# EAGLE design powerSwitch011 (EAGLE 5.12)

## Sheet 1 of 3
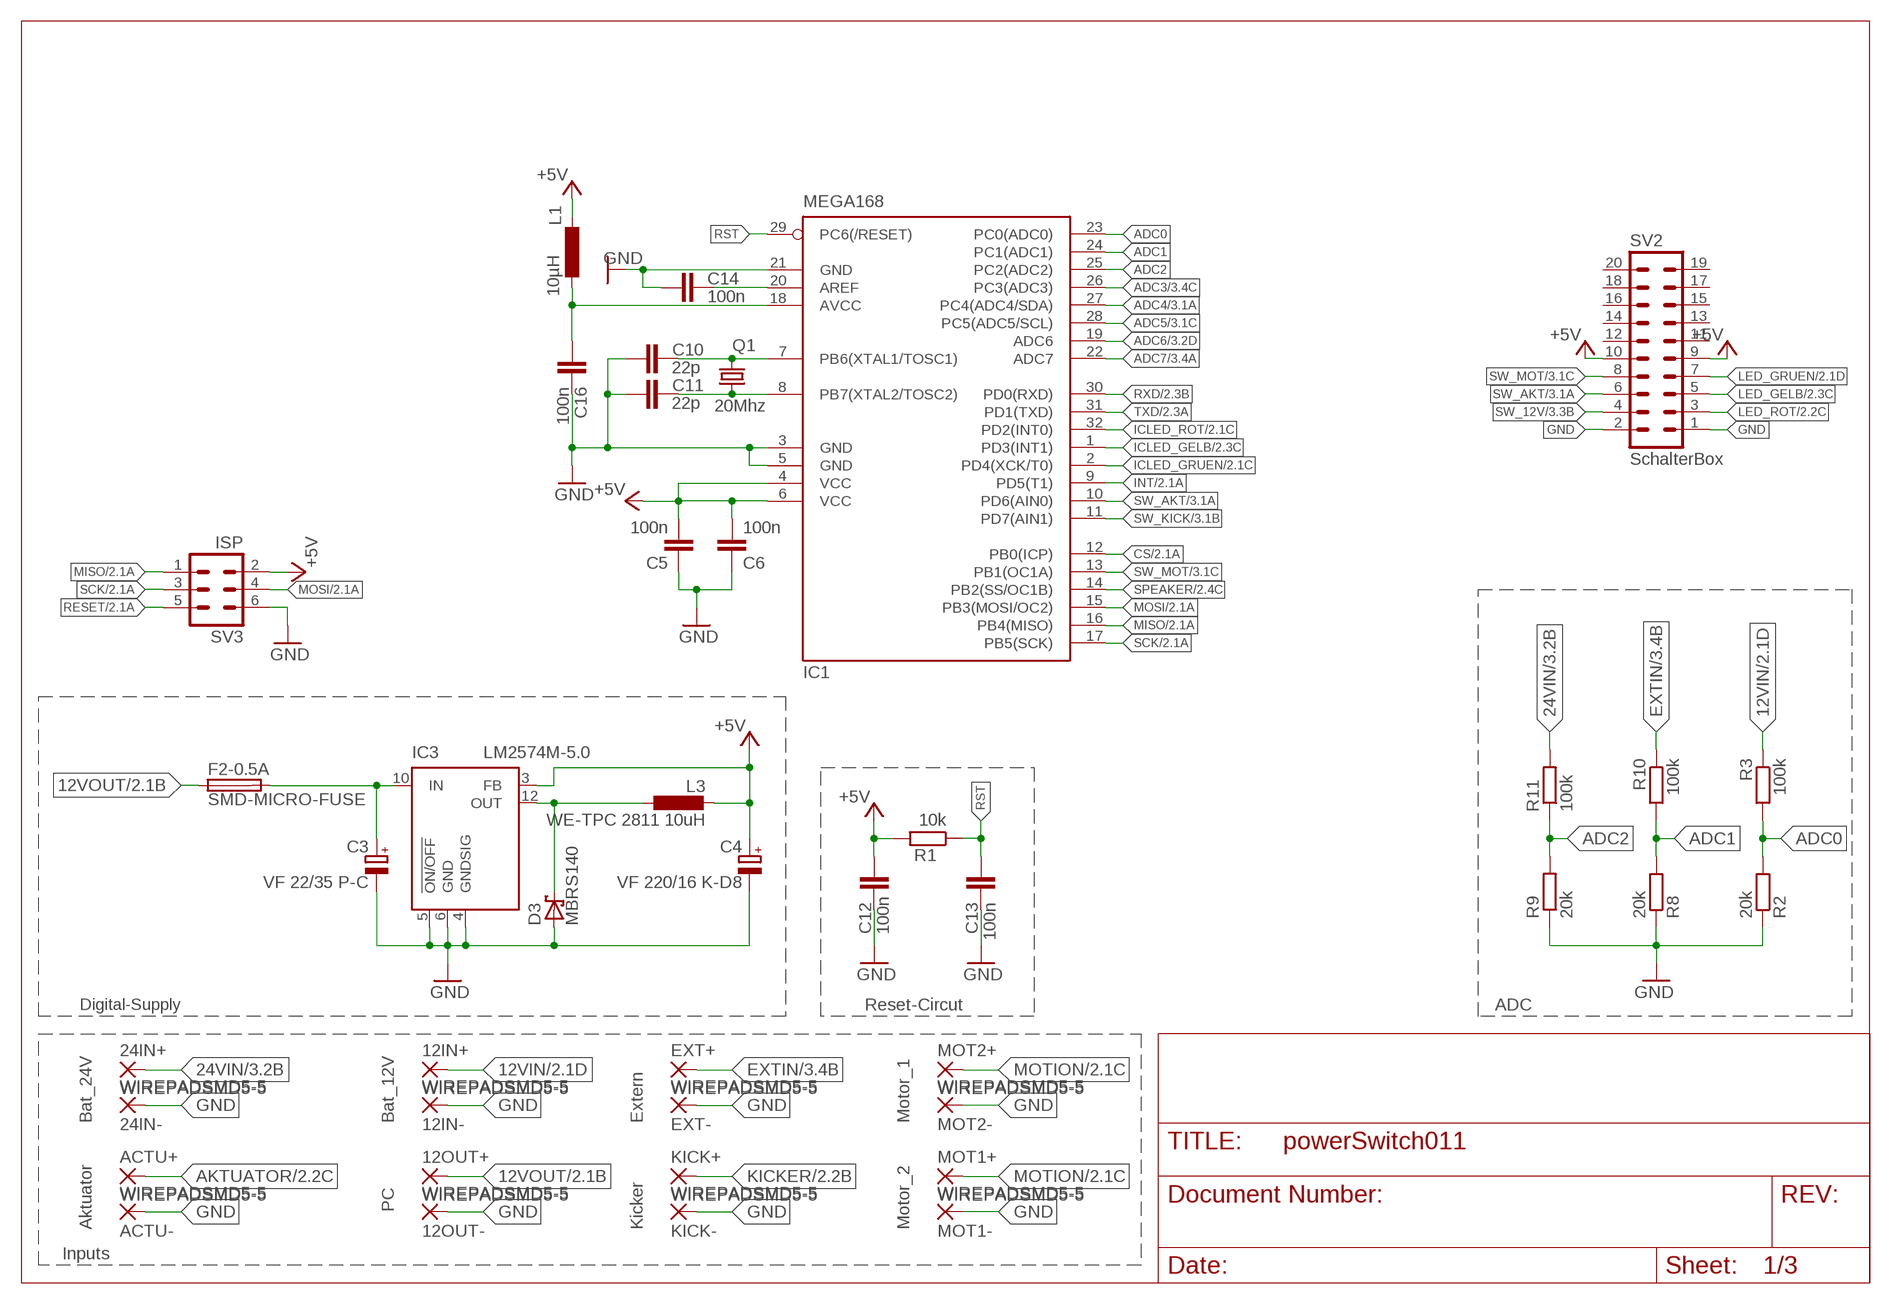
[diagram p0: schematic, sheet 1]

### Parts
12IN+  WIREPADSMD5-5  [5-5]
12IN-  WIREPADSMD5-5  [5-5]
12OUT+  WIREPADSMD5-5  [5-5]
12OUT-  WIREPADSMD5-5  [5-5]
24IN+  WIREPADSMD5-5  [5-5]
24IN-  WIREPADSMD5-5  [5-5]
ACTU+  WIREPADSMD5-5  [5-5]
ACTU-  WIREPADSMD5-5  [5-5]
C3  VF 22/35 P-C  CPOL-EUC  [PANASONIC_C]
C4  VF 220/16 K-D8  CPOL-EUD  [PANASONIC_D]
C5  100n  C-EUC0603K  [C0603K]
C6  100n  C-EUC0603K  [C0603K]
C10  22p  C-EUC0603K  [C0603K]
C11  22p  C-EUC0603K  [C0603K]
C12  100n  C-EUC0603K  [C0603K]
C13  100n  C-EUC0603K  [C0603K]
C14  100n  C-EUC0603K  [C0603K]
C16  100n  C-EUC0603K  [C0603K]
D3  MBRS140  SCHOTTKY-DIODESMD  [SMB]
EXT+  WIREPADSMD5-5  [5-5]
EXT-  WIREPADSMD5-5  [5-5]
F2-0.5A  SMD-MICRO-FUSE  [SMD-6,1X2,6]
IC1  MEGA168  MEGA8-AI  [TQFP32-08]
IC3  LM2574M-5.0  [SO14W]
KICK+  WIREPADSMD5-5  [5-5]
KICK-  WIREPADSMD5-5  [5-5]
L1  10µH  L-EU-0805L0805  [R0805]
L3  WE-TPC 2811 10uH  L-EUWE-TPC  [POWER-CHOKE_WE-TPC]
MOT1+  WIREPADSMD5-5  [5-5]
MOT1-  WIREPADSMD5-5  [5-5]
MOT2+  WIREPADSMD5-5  [5-5]
MOT2-  WIREPADSMD5-5  [5-5]
Q1  20Mhz  CRYTALHC49U-V  [HC49U-V@1]
R1  10k  R-EU_R0805  [R0805]
R2  20k  R-EU_R0805  [R0805]
R3  100k  R-EU_R0805  [R0805]
R8  20k  R-EU_R0805  [R0805]
R9  20k  R-EU_R0805  [R0805]
R10  100k  R-EU_R0805  [R0805]
R11  100k  R-EU_R0805  [R0805]
SV2  SchalterBox  ML20L  [ML20L]
SV3  ISP  ML6  [ML6]

### Nets
12VIN: 12IN+.P$1(P) R3.1 ; also sheet 2,3
12VOUT: 12OUT+.P$1(P) F2-0.5A.1 ; also sheet 2,3
24VIN: 24IN+.P$1(P) R11.2 ; also sheet 3
+5V: C4.+ C5.2 C6.2 C12.2 IC1.4(VCC) IC1.6(VCC) IC3.3(FB) L1.2 L3.2 R1.2 SV2.9 SV2.10 SV3.2 ; also sheet 2
ADC0: IC1.23(PC0(ADC0)) R2.2 R3.2
ADC1: IC1.24(PC1(ADC1)) R8.2 R10.2
ADC2: IC1.25(PC2(ADC2)) R9.2 R11.1
ADC3: IC1.26(PC3(ADC3)) ; also sheet 3
ADC4: IC1.27(PC4(ADC4/SDA)) ; also sheet 3
ADC5: IC1.28(PC5(ADC5/SCL)) ; also sheet 3
ADC6: IC1.19(ADC6) ; also sheet 3
ADC7: IC1.22(ADC7) ; also sheet 3
AKTUATOR: ACTU+.P$1(P) ; also sheet 2,3
CS: IC1.12(PB0(ICP)) ; also sheet 2
EXTIN: EXT+.P$1(P) R10.1 ; also sheet 3
GND: 12IN-.P$1(P) 12OUT-.P$1(P) 24IN-.P$1(P) ACTU-.P$1(P) C3.- C4.- C5.1 C6.1 C10.1 C11.1 C12.1 C13.1 C14.1 C16.2 D3.A EXT-.P$1(P) IC1.3(GND) IC1.5(GND) IC1.21(GND) IC3.4(GNDSIG) IC3.5(!ON/OFF) IC3.6(GND) KICK-.P$1(P) MOT1-.P$1(P) MOT2-.P$1(P) R2.1 R8.1 R9.1 SV2.1 SV2.2 SV3.6 ; also sheet 2,3
ICLED_GELB: IC1.1(PD3(INT1)) ; also sheet 2
ICLED_GRUEN: IC1.2(PD4(XCK/T0)) ; also sheet 2
ICLED_ROT: IC1.32(PD2(INT0)) ; also sheet 2
INT: IC1.9(PD5(T1)) ; also sheet 2
KICKER: KICK+.P$1(P) ; also sheet 2,3
LED_GELB: SV2.5 ; also sheet 2
LED_GRUEN: SV2.7 ; also sheet 2
LED_ROT: SV2.3 ; also sheet 2
MISO: IC1.16(PB4(MISO)) SV3.1 ; also sheet 2
MOSI: IC1.15(PB3(MOSI/OC2)) SV3.4 ; also sheet 2
MOTION: MOT1+.P$1(P) MOT2+.P$1(P) ; also sheet 2,3
N$10: C10.2 IC1.7(PB6(XTAL1/TOSC1)) Q1.2
N$11: C11.2 IC1.8(PB7(XTAL2/TOSC2)) Q1.1
N$13: C14.2 IC1.20(AREF)
N$14: C16.1 IC1.18(AVCC) L1.1
N$22: C3.+ F2-0.5A.2 IC3.10(IN)
N$64: D3.C IC3.12(OUT) L3.1
RESET: SV3.5 ; also sheet 2
RST: C13.2 IC1.29(PC6(/RESET)) R1.1
RXD: IC1.30(PD0(RXD)) ; also sheet 2
SCK: IC1.17(PB5(SCK)) SV3.3 ; also sheet 2
SPEAKER: IC1.14(PB2(SS/OC1B)) ; also sheet 2
SW_12V: SV2.4 ; also sheet 3
SW_AKT: IC1.10(PD6(AIN0)) SV2.6 ; also sheet 3
SW_KICK: IC1.11(PD7(AIN1)) ; also sheet 3
SW_MOT: IC1.13(PB1(OC1A)) SV2.8 ; also sheet 3
TXD: IC1.31(PD1(TXD)) ; also sheet 2
Unconnected: SV2.11 SV2.12 SV2.13 SV2.14 SV2.15 SV2.16 SV2.17 SV2.18 SV2.19 SV2.20

### Notes on the sheet
- Digital-Supply | Reset-Circut | ADC
- Bat_24V | Bat_12V | Extern | Motor_1
- PC
- Aktuator | Kicker | Motor_2
- Inputs

## Sheet 2 of 3
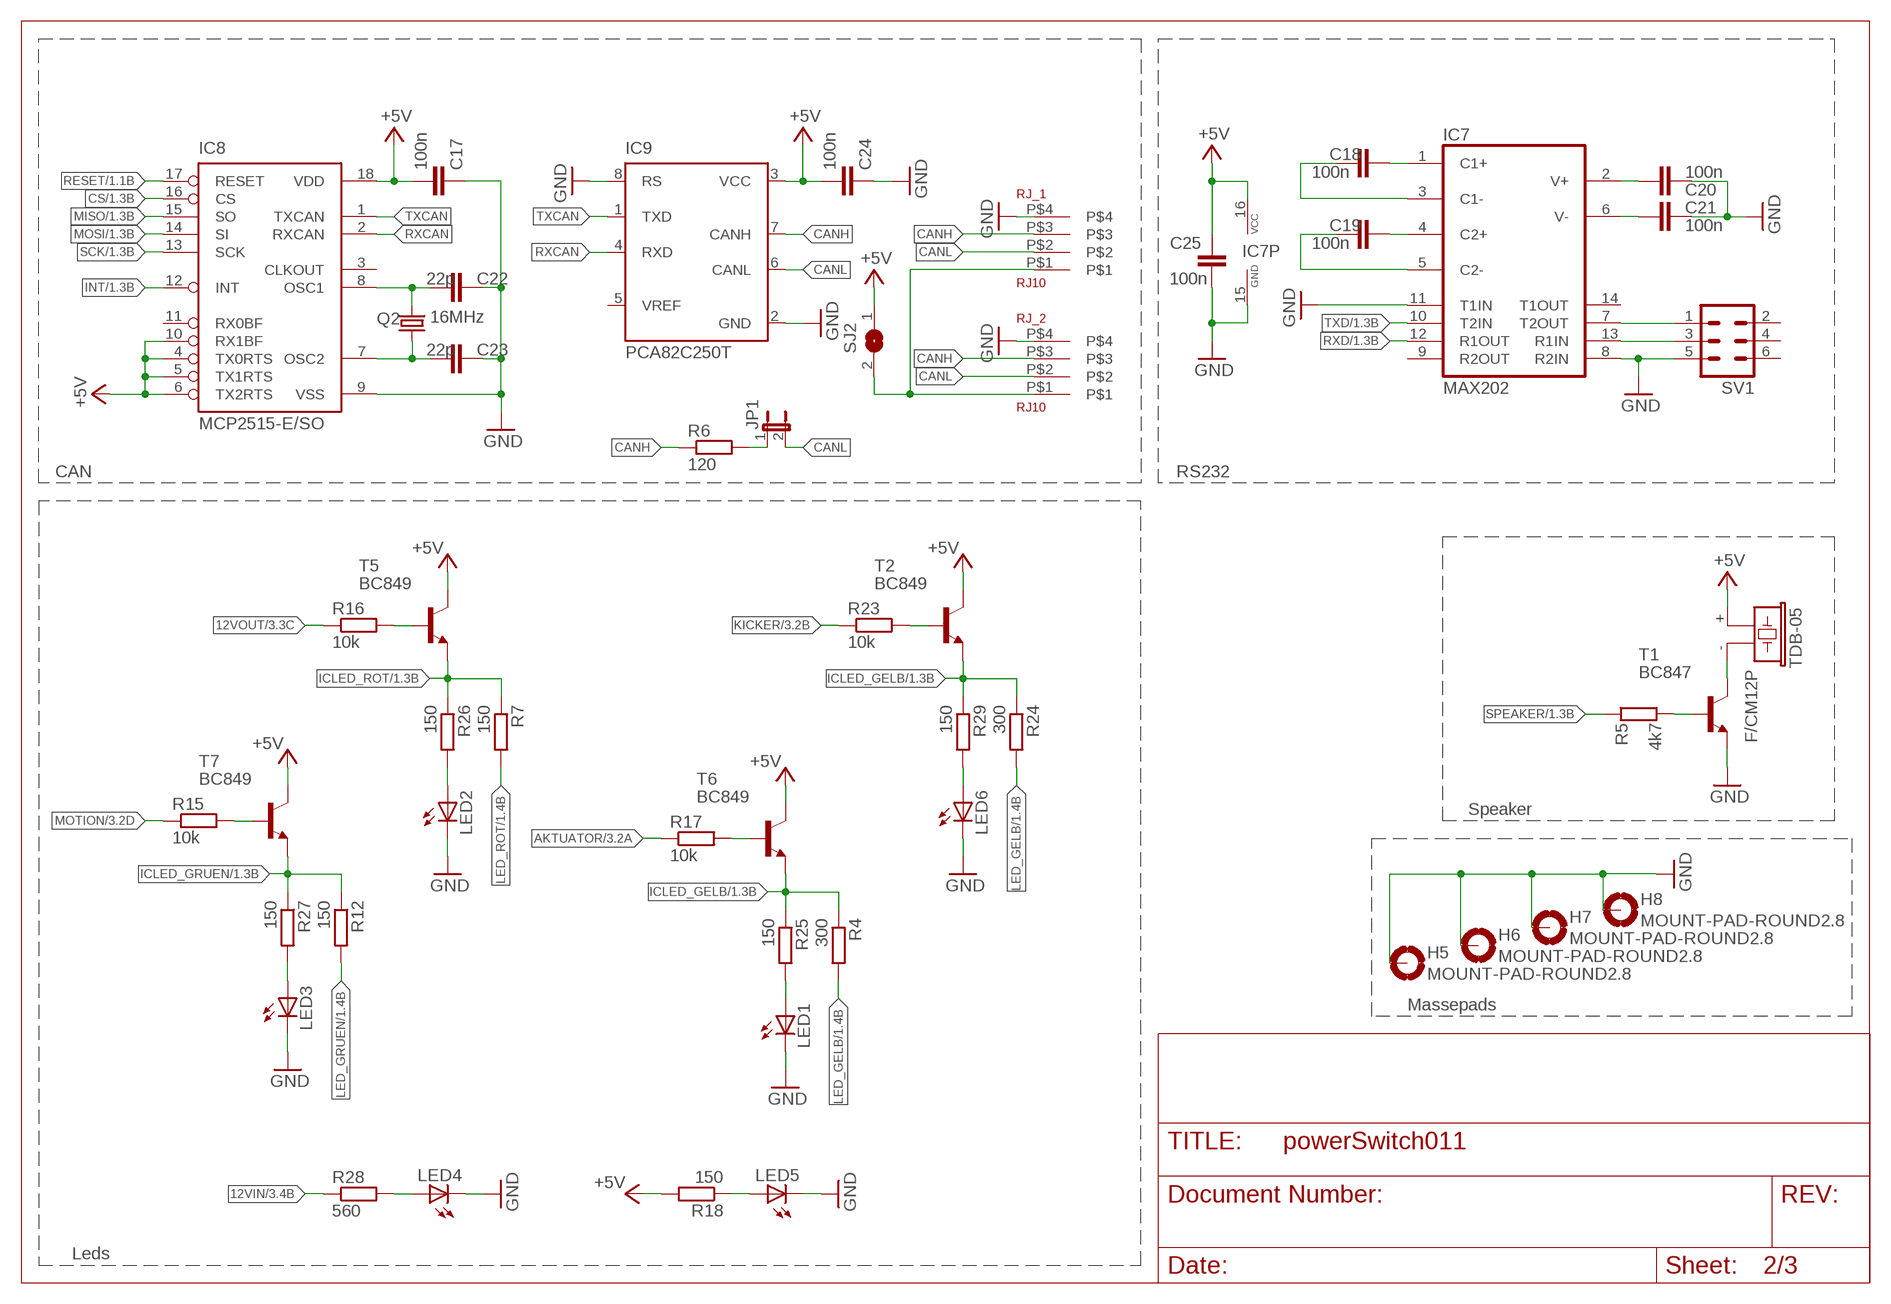
[diagram p1: schematic, sheet 2]

### Parts
C17  100n  C-EUC0603  [C0603]
C18  100n  C-EUC0603K  [C0603K]
C19  100n  C-EUC0603K  [C0603K]
C20  100n  C-EUC0603K  [C0603K]
C21  100n  C-EUC0603K  [C0603K]
C22  22p  C-EUC0603  [C0603]
C23  22p  C-EUC0603  [C0603]
C24  100n  C-EUC0603  [C0603]
C25  100n  C-EUC0603K  [C0603K]
H5  MOUNT-PAD-ROUND2.8  [2,8-PAD]
H6  MOUNT-PAD-ROUND2.8  [2,8-PAD]
H7  MOUNT-PAD-ROUND2.8  [2,8-PAD]
H8  MOUNT-PAD-ROUND2.8  [2,8-PAD]
IC7  MAX202  MAX3232CSE  [SO16]
IC8  MCP2515-E/SO  [SO18L]
IC9  PCA82C250T  [SO8]
JP1  JP1E  [JP1]
LED1  LEDCHIPLED_0805  [CHIPLED_0805]
LED2  LEDCHIPLED_0805  [CHIPLED_0805]
LED3  LEDCHIPLED_0805  [CHIPLED_0805]
LED4  LEDCHIPLED_0805  [CHIPLED_0805]
LED5  LEDCHIPLED_0805  [CHIPLED_0805]
LED6  LEDCHIPLED_0805  [CHIPLED_0805]
Q2  16MHz  CRYSTALHC49U-V  [HC49U-V]
R4  300  R-EU_R0805  [R0805]
R5  4k7  R-EU_R0805  [R0805]
R6  120  R-EU_M0805  [M0805]
R7  150  R-EU_R0805  [R0805]
R12  150  R-EU_R0805  [R0805]
R15  10k  R-EU_R0805  [R0805]
R16  10k  R-EU_R0805  [R0805]
R17  10k  R-EU_R0805  [R0805]
R18  150  R-EU_R0805  [R0805]
R23  10k  R-EU_R0805  [R0805]
R24  300  R-EU_R0805  [R0805]
R25  150  R-EU_R0805  [R0805]
R26  150  R-EU_R0805  [R0805]
R27  150  R-EU_R0805  [R0805]
R28  560  R-EU_R0805  [R0805]
R29  150  R-EU_R0805  [R0805]
RJ_1  RJ10  [RJ10]
RJ_2  RJ10  [RJ10]
SJ2  SJ  [SJ]
SV1  ML6  [ML6]
T1  BC847  [SOT23]
T2  BC849  [SOT23]
T5  BC849  [SOT23]
T6  BC849  [SOT23]
T7  BC849  [SOT23]
TDB-05  F/CM12P  [F/CM12P]

### Nets
12VIN: R28.1 ; also sheet 1,3
12VOUT: R16.1 ; also sheet 1,3
+5V: C17.2 C24.2 C25.1 IC7.16(VCC) IC8.4(TX0RTS) IC8.5(TX1RTS) IC8.6(TX2RTS) IC8.10(RX1BF) IC8.18(VDD) IC9.3(VCC) R18.2 SJ2.1 T2.3(C) T5.3(C) T6.3(C) T7.3(C) TDB-05.+ ; also sheet 1
AKTUATOR: R17.1 ; also sheet 1,3
CANH: IC9.7(CANH) R6.1 RJ_1.P$3 RJ_2.P$3
CANL: IC9.6(CANL) JP1.2 RJ_1.P$2 RJ_2.P$2
CS: IC8.16(CS) ; also sheet 1
GND: C17.1 C20.2 C21.2 C22.2 C23.2 C24.1 C25.2 H5.B2,8(MOUNT) H6.B2,8(MOUNT) H7.B2,8(MOUNT) H8.B2,8(MOUNT) IC7.8(R2IN) IC7.11(T1IN) IC7.15(GND) IC8.9(VSS) IC9.2(GND) IC9.8(RS) LED1.C LED2.C LED3.C LED4.C LED5.C LED6.C RJ_1.P$4 RJ_2.P$4 SV1.5 T1.2(E) ; also sheet 1,3
ICLED_GELB: R4.1 R24.1 R25.1 R29.1 T2.2(E) T6.2(E) ; also sheet 1
ICLED_GRUEN: R12.1 R27.1 T7.2(E) ; also sheet 1
ICLED_ROT: R7.1 R26.1 T5.2(E) ; also sheet 1
INT: IC8.12(INT) ; also sheet 1
KICKER: R23.1 ; also sheet 1,3
LED_GELB: R4.2 R24.2 ; also sheet 1
LED_GRUEN: R12.2 ; also sheet 1
LED_ROT: R7.2 ; also sheet 1
MISO: IC8.15(SO) ; also sheet 1
MOSI: IC8.14(SI) ; also sheet 1
MOTION: R15.1 ; also sheet 1,3
N$1: R5.2 T1.1(B)
N$2: RJ_1.P$1 RJ_2.P$1 SJ2.2
N$4: R23.2 T2.1(B)
N$5: LED6.A R29.2
N$7: JP1.1 R6.2
N$8: LED1.A R25.2
N$9: LED2.A R26.2
N$15: C18.2 IC7.1(C1+)
N$18: C19.2 IC7.4(C2+)
N$20: T1.3(C) TDB-05.-
N$21: LED3.A R27.2
N$24: LED4.A R28.2
N$32: C22.1 IC8.8(OSC1) Q2.2
N$34: C23.1 IC8.7(OSC2) Q2.1
N$35: C18.1 IC7.3(C1-)
N$36: C19.1 IC7.5(C2-)
N$37: C20.1 IC7.2(V+)
N$38: C21.1 IC7.6(V-)
N$40: IC7.13(R1IN) SV1.3
N$41: IC7.7(T2OUT) SV1.1
N$102: R16.2 T5.1(B)
N$104: R17.2 T6.1(B)
N$106: R15.2 T7.1(B)
N$108: LED5.A R18.1
RESET: IC8.17(RESET) ; also sheet 1
RXCAN: IC8.2(RXCAN) IC9.4(RXD)
RXD: IC7.12(R1OUT) ; also sheet 1
SCK: IC8.13(SCK) ; also sheet 1
SPEAKER: R5.1 ; also sheet 1
TXCAN: IC8.1(TXCAN) IC9.1(TXD)
TXD: IC7.10(T2IN) ; also sheet 1
Unconnected: IC7.9(R2OUT) IC7.14(T1OUT) IC8.3(CLKOUT) IC8.11(RX0BF) IC9.5(VREF) SV1.2 SV1.4 SV1.6

### Notes on the sheet
- CAN | RS232
- Speaker
- Massepads
- Leds

## Sheet 3 of 3
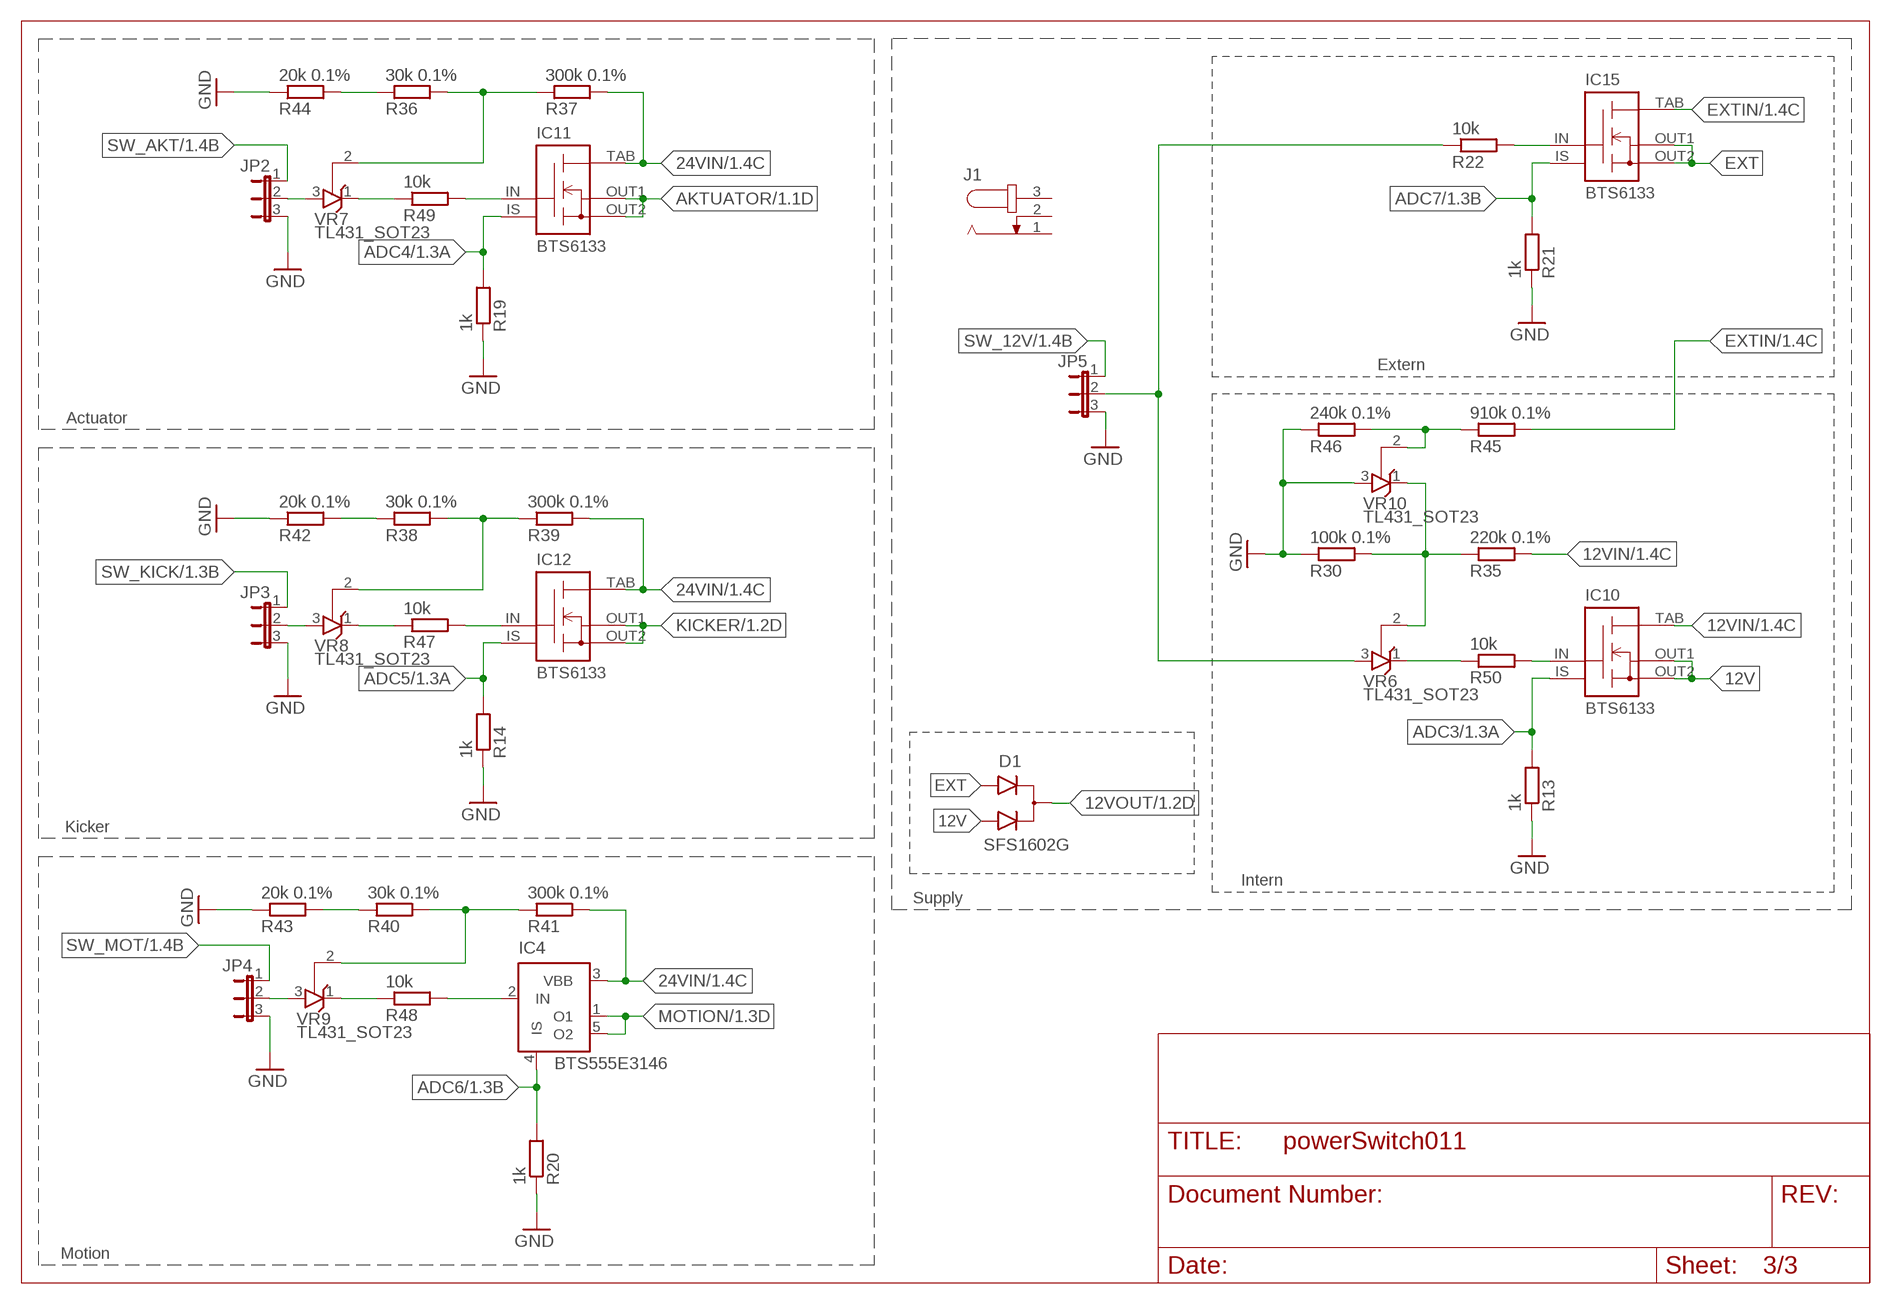
[diagram p2: schematic, sheet 3]

### Parts
D1  SFS1602G  SFS160G  [D2PAK]
IC4  BTS555E3146  [TO220-52]
IC10  BTS6133  [TO252-51]
IC11  BTS6133  [TO252-51]
IC12  BTS6133  [TO252-51]
IC15  BTS6133  [TO252-51]
J1  JACK-PLUG0  [SPC4077]
JP2  JP2E  [JP2]
JP3  JP2E  [JP2]
JP4  JP2E  [JP2]
JP5  JP2E  [JP2]
R13  1k  R-EU_R0805  [R0805]
R14  1k  R-EU_R0805  [R0805]
R19  1k  R-EU_R0805  [R0805]
R20  1k  R-EU_R0805  [R0805]
R21  1k  R-EU_R0805  [R0805]
R22  10k  R-EU_R0805  [R0805]
R30  100k 0.1%  R-EU_R0805  [R0805]
R35  220k 0.1%  R-EU_R0805  [R0805]
R36  30k 0.1%  R-EU_R0805  [R0805]
R37  300k 0.1%  R-EU_R0805  [R0805]
R38  30k 0.1%  R-EU_R0805  [R0805]
R39  300k 0.1%  R-EU_R0805  [R0805]
R40  30k 0.1%  R-EU_R0805  [R0805]
R41  300k 0.1%  R-EU_R0805  [R0805]
R42  20k 0.1%  R-EU_R0805  [R0805]
R43  20k 0.1%  R-EU_R0805  [R0805]
R44  20k 0.1%  R-EU_R0805  [R0805]
R45  910k 0.1%  R-EU_R0805  [R0805]
R46  240k 0.1%  R-EU_R0805  [R0805]
R47  10k  R-EU_R0805  [R0805]
R48  10k  R-EU_R0805  [R0805]
R49  10k  R-EU_R0805  [R0805]
R50  10k  R-EU_R0805  [R0805]
VR6  TL431_SOT23  [SOT23]
VR7  TL431_SOT23  [SOT23]
VR8  TL431_SOT23  [SOT23]
VR9  TL431_SOT23  [SOT23]
VR10  TL431_SOT23  [SOT23]

### Nets
12V: D1.P$2 IC10.OUT1(OUT) IC10.OUT2(OUT)
12VIN: IC10.TAB(VBB) R35.2 ; also sheet 1,2
12VOUT: D1.P$3 ; also sheet 1,2
24VIN: IC4.3(VBB) IC11.TAB(VBB) IC12.TAB(VBB) R37.2 R39.2 R41.2 ; also sheet 1
ADC3: IC10.IS R13.2 ; also sheet 1
ADC4: IC11.IS R19.2 ; also sheet 1
ADC5: IC12.IS R14.2 ; also sheet 1
ADC6: IC4.4(IS) R20.2 ; also sheet 1
ADC7: IC15.IS R21.2 ; also sheet 1
AKTUATOR: IC11.OUT1(OUT) IC11.OUT2(OUT) ; also sheet 1,2
EXT: D1.P$1 IC15.OUT1(OUT) IC15.OUT2(OUT)
EXTIN: IC15.TAB(VBB) R45.2 ; also sheet 1
GND: JP2.3 JP3.3 JP4.3 JP5.3 R13.1 R14.1 R19.1 R20.1 R21.1 R30.1 R42.1 R43.1 R44.1 R46.1 VR10.3(A) ; also sheet 1,2
KICKER: IC12.OUT1(OUT) IC12.OUT2(OUT) ; also sheet 1,2
MOTION: IC4.1(O1) IC4.5(O2) ; also sheet 1,2
N$3: IC15.IN R22.2
N$12: JP2.2 VR7.3(A)
N$19: JP4.2 VR9.3(A)
N$23: JP3.2 VR8.3(A)
N$25: JP5.2 R22.1 VR6.3(A)
N$28: IC10.IN R50.2
N$33: R30.2 R35.1 VR6.2(R) VR10.1(C)
N$39: R49.1 VR7.1(C)
N$42: R36.2 R37.1 VR7.2(R)
N$43: IC12.IN R47.2
N$44: R38.2 R39.1 VR8.2(R)
N$45: R40.2 R41.1 VR9.2(R)
N$46: IC4.2(IN) R48.2
N$47: R38.1 R42.2
N$48: R40.1 R43.2
N$49: R36.1 R44.2
N$50: R45.1 R46.2 VR10.2(R)
N$51: R47.1 VR8.1(C)
N$52: R48.1 VR9.1(C)
N$53: IC11.IN R49.2
N$54: R50.1 VR6.1(C)
SW_12V: JP5.1 ; also sheet 1
SW_AKT: JP2.1 ; also sheet 1
SW_KICK: JP3.1 ; also sheet 1
SW_MOT: JP4.1 ; also sheet 1
Unconnected: J1.1 J1.2 J1.3

### Notes on the sheet
- Extern
- Actuator
- Kicker
- Intern
- Supply
- Motion

## Library data of the parts
12IN+ 12IN- 12OUT+ 12OUT- 24IN+ 24IN- ACTU+ ACTU- EXT+ EXT- KICK+ KICK- MOT1+ MOT1- MOT2+ MOT2- = mywirepad:WIREPAD: Wire PAD connect wire on PCB
C3 C4 = rcl:CPOL-EU: POLARIZED CAPACITOR, European symbol
C5 C6 C10-C14 C16-C25 = rcl:C-EU: CAPACITOR, European symbol
D1 = ownParts:SFS160*G
D3 = diode:SCHOTTKY-DIODE: Schottky Diode
F2-0.5A = f-lf-omniblok-s:SMD-MICRO-FUSE
H5-H8 = holes:MOUNT-PAD-ROUND: MOUNTING PAD, round
IC1 = atmel:MEGA8: MICROCONTROLLER 8 Kbytes FLASH, 1 kbytes SRAM, 512 bytes EEPROM, USART, 6-channel 10 bit ADC, 2-channel 8 bit ADC Pin compatible with Atmega48, ATMega88, ATMega168 Source: avr.lbr; MPN: ATMEGA8-16AU; OC_FARNELL: 9171371; OC_NEWARK: 73M8863
IC3 = linear:LM2574?-*: SIMPLE SWITCHER 0.5A Step-Down Voltage Regulator Source: http://cache.national.com/ds/LM/LM2574.pdf
IC4 = infineon:BTS555: PROFET® Data Sheet BTS555 Source: http://www.infineon.com/upload/Document/cmc_upload/documents/011/8726/Datasheet_BTS555.pdf; OC_FARNELL: unknown; OC_NEWARK: unknown
IC7 = maxim:MAX3232*: True RS-232 Transceivers 3.0V to 5.5V, Low-Power up to 1Mbps, Using Four 0.1µF External Capacitors Source: http://pdfserv.maxim-ic.com/en/ds/MAX3222-MAX3241.pdf; MPN: MAX3232CSE; OC_FARNELL: 9725490; OC_NEWARK: 90C2890
IC8 = mcp2515:MCP2515
IC9 = micro-philips:PCA82C250: CAN CONTROLLER INTERFACE; OC_FARNELL: 1085275; OC_NEWARK: unknown
IC10-IC12 IC15 = BTS443P:BTS6133
J1 = con-jack:JACK-PLUG: DC POWER JACK Power Jack, DC, Right Angle, Through Hole, Rated 5A at 16VDC, PC Terminals Distributor: Farnell (www.Farnell.de) Drawing: 84N1161.pdf / 84N1162.pdf Manufacturer: SPC Technology (www.spctechnology.com) Type: SPC4077 / SPC 4078; OC_FARNELL: unknown; OC_NEWARK: unknown
JP1 = jumper:JP1E: JUMPER
JP2-JP5 = jumper:JP2E: JUMPER
L1 = myrcl:L-EU-0805
L3 = rcl:L-EU: INDUCTOR, European symbol
LED1-LED6 = led:LED: LED OSRAM: - CHIPLED LG R971, LG N971, LY N971, LG Q971, LY Q971, LO R971, LY R971 LH N974, LH R974 LS Q976, LO Q976, LY Q976 LO Q996 - Hyper CHIPLED LW Q18S LB Q993, LB Q99A, LB R99A - SideLED LS A670, LO A670, LY A670, LG A670, LP A670 LB A673, LV A673, LT A673, LW A673 LH A674 LY A675 LS A676, LA A676, LO A676, LY A676, LW A676 LS A679, LY A679, LG A679 - Hyper Micro SIDELED® LS Y876, LA Y876, LO Y876, LY Y876 LT Y87S - SmartLED LW L88C, LW L88S LB L89C, LB L89S, LG L890 LS L89K, LO L89K, LY L89K LS L896, LA L896, LO L896, LY L896 - TOPLED LS T670, LO T670, LY T670, LG T670, LP T670 LSG T670, LSP T670, LSY T670, LOP T670, LYG T670 LG T671, LOG T671, LSG T671 LB T673, LV T673, LT T673, LW T673 LH T674 LS T676, LA T676, LO T676, LY T676, LB T676, LH T676, LSB T676, LW T676 LB T67C, LV T67C, LT T67C, LS T67K, LO T67K, LY T67K, LW E67C LS E67B, LA E67B, LO E67B, LY E67B, LB E67C, LV E67C, LT E67C LW T67C LS T679, LY T679, LG T679 LS T770, LO T770, LY T770, LG T770, LP T770 LB T773, LV T773, LT T773, LW T773 LH T774 LS E675, LA E675, LY E675, LS T675 LS T776, LA T776, LO T776, LY T776, LB T776 LHGB T686 LT T68C, LB T68C - Hyper Mini TOPLED® LB M676 - Mini TOPLED Santana® LG M470 LS M47K, LO M47K, LY M47K Source: http://www.osram.convergy.de LUXEON: - LUMILED® LXK2-PW12-R00, LXK2-PW12-S00, LXK2-PW14-U00, LXK2-PW14-V00 LXK2-PM12-R00, LXK2-PM12-S00, LXK2-PM14-U00 LXK2-PE12-Q00, LXK2-PE12-R00, LXK2-PE12-S00, LXK2-PE14-T00, LXK2-PE14-U00 LXK2-PB12-K00, LXK2-PB12-L00, LXK2-PB12-M00, LXK2-PB14-N00, LXK2-PB14-P00, LXK2-PB14-Q00 LXK2-PR12-L00, LXK2-PR12-M00, LXK2-PR14-Q00, LXK2-PR14-R00 LXK2-PD12-Q00, LXK2-PD12-R00, LXK2-PD12-S00 LXK2-PH12-R00, LXK2-PH12-S00 LXK2-PL12-P00, LXK2-PL12-Q00, LXK2-PL12-R00 Source: www.luxeon.com KINGBRIGHT: KA-3528ASYC Source: www.kingbright.com
Q1 = crystal:CRYTAL: CRYSTAL
Q2 = crystal:CRYSTAL: CRYSTAL; OC_FARNELL: 1666969; OC_NEWARK: unknown
R1-R30 R35-R50 = rcl:R-EU_: RESISTOR, European symbol
RJ_1 RJ_2 = ownParts:RJ10
SJ2 = jumper:SJ: SMD solder JUMPER
SV1 SV3 = con-ml:ML6: HARTING; OC_FARNELL: unknown; OC_NEWARK: unknown
SV2 = con-ml:ML20L: HARTING; OC_FARNELL: unknown; OC_NEWARK: unknown
T1 = transistor:BC847: NPN TRANSISTOR
T2 T5-T7 = transistor:BC849: NPN TRANSISTOR
TDB-05 = buzzer:F/CM12P: BUZZER Source: Buerklin; OC_FARNELL: unknown; OC_NEWARK: unknown
VR6-VR10 = 1_USER:TL431

## Board
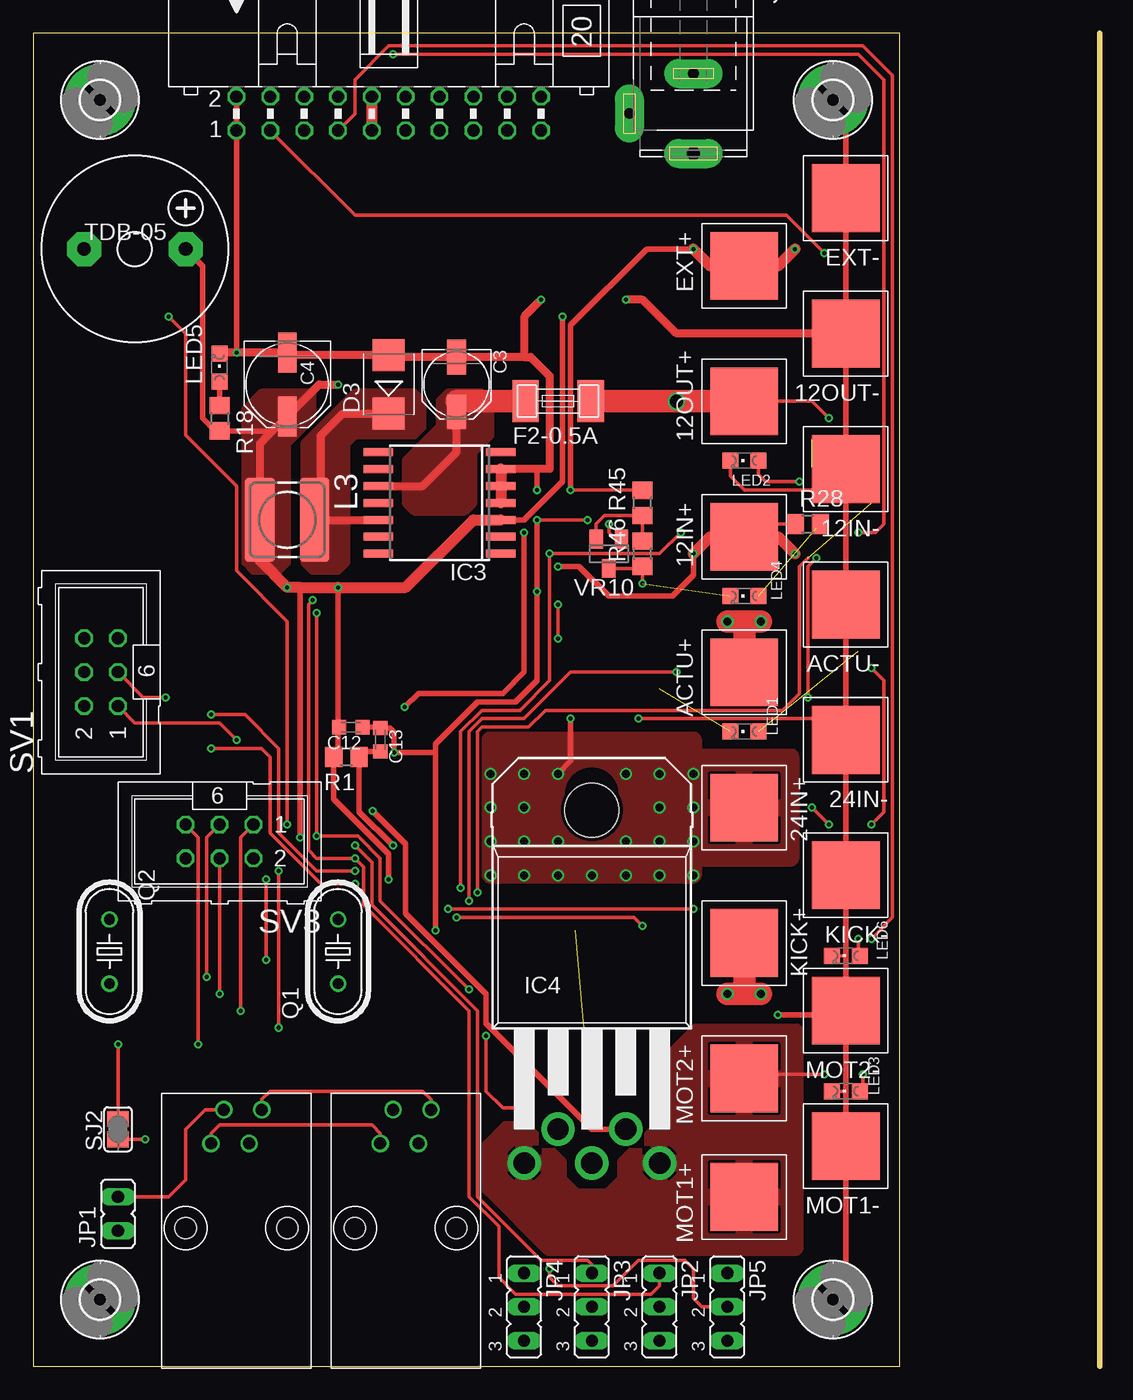
[diagram p3: board, top side]
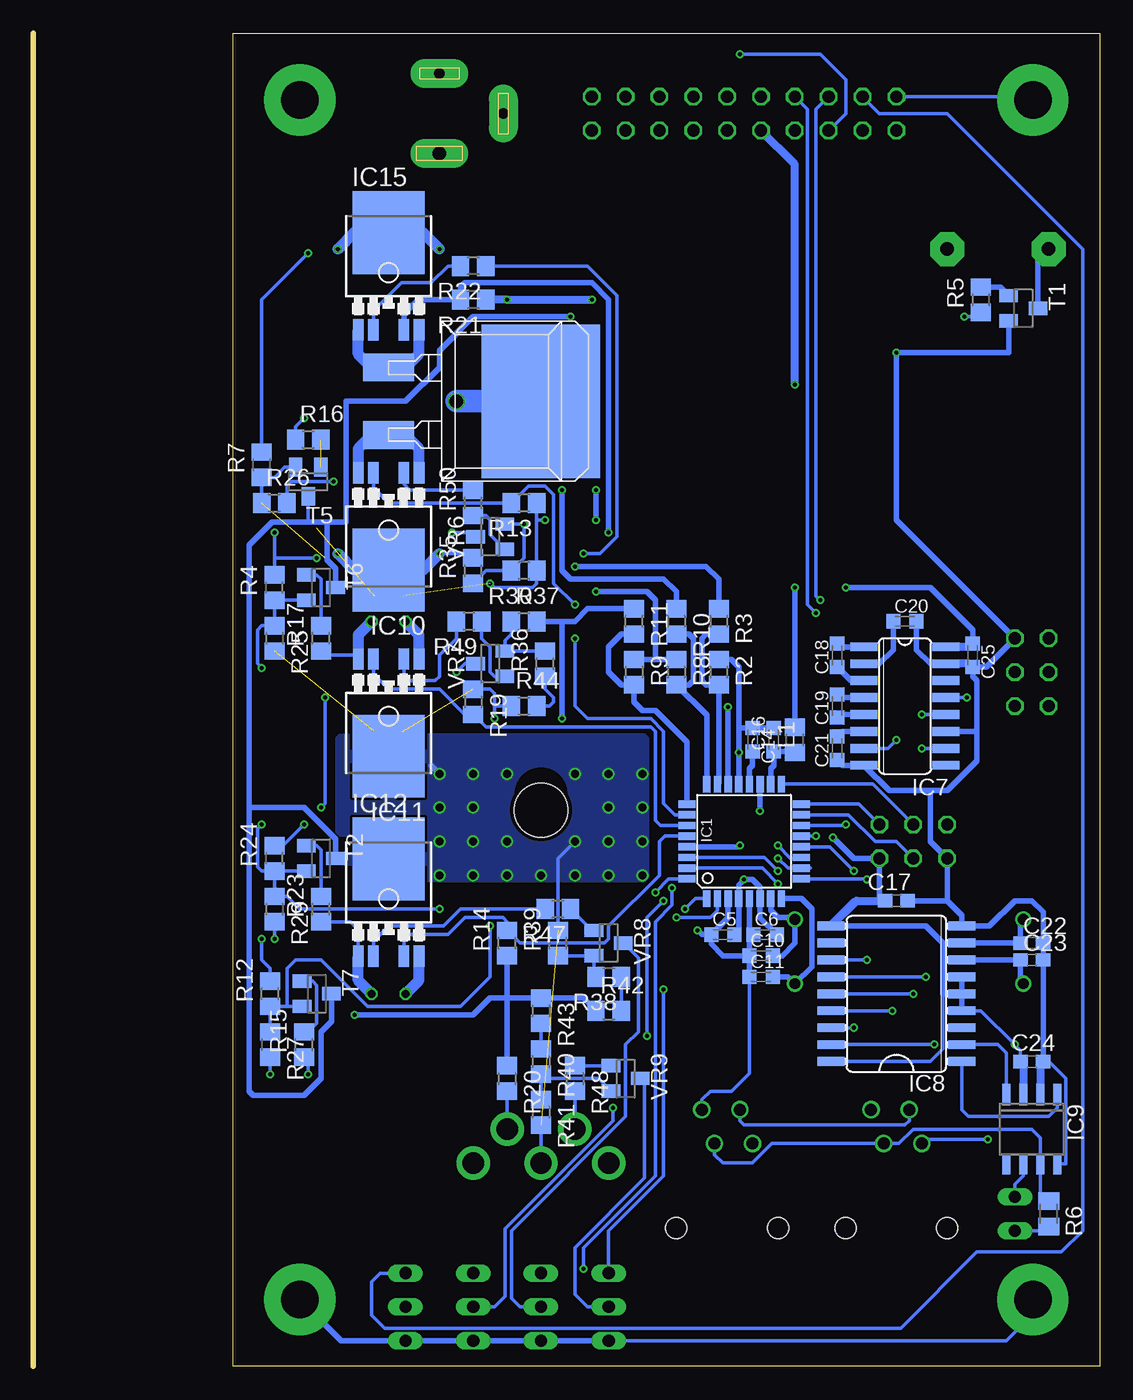
[diagram p4: board, bottom side, seen from below]

Size 80 x 100 mm. Coordinates in mm from the lower left corner, seen from the top.
Outline: 80,100 80,0
Outline: 0,0 65,0 65,100 0,100 0,0
Copper layers (1*16): Top 0.035mm / dielectric 1.5mm / Bottom 0.035mm
Design rules "PCB-POOL Standard *": minimum track width 0.15mm, minimum drill 0.3mm, track to track 0.15mm, track to pad 0.15mm, pad to pad 0.15mm, via to via 0.15mm, smd to smd 0.15mm, copper to edge 0.3mm, drill to drill 0.2mm, minimum pad ring 0.2mm, minimum via ring 0.15mm, stop-mask expansion 0.075mm, vias tented up to drill 0mil, thermal gap 0.2mm

### Footprints (pad centres in the part's own frame; a part is rotated, then mirrored left to right if it is on the bottom)
5-5 = smd 5.08 x 5.08: P$1 0,0
PANASONIC_C = smd 2.6 x 1.4: + 2.05,0; - -2.05,0
PANASONIC_D = smd 3 x 1.4: + 2.4,0; - -2.4,0
C0603K = smd 1.05 x 1.08: 1 -0.875,0; 2 0.875,0
C0603 = smd 1.1 x 1: 1 -0.85,0; 2 0.85,0
D2PAK = smd 2.08 x 3.81: P$1 -2.54,-6.985; P$2 2.54,-6.985 | smd 11.5 x 8.89: P$3 0,4.445
SMB = smd 2.4 x 2.4: A 2.2,0; C -2.2,0
SMD-6,1X2,6 = smd 1.96 x 3.15: 1 -2.45,0; 2 2.45,0
2,8-PAD = drill 2.8 pad 5.334 round: B2,8 0,0
TQFP32-08 = smd 1.27 x 0.559: 1 -4.293,2.8; 2 -4.293,2; 3 -4.293,1.2; 4 -4.293,0.4; 5 -4.293,-0.4; 6 -4.293,-1.2; 7 -4.293,-2; 8 -4.293,-2.8; 17 4.293,-2.8; 18 4.293,-2; 19 4.293,-1.2; 20 4.293,-0.4; 21 4.293,0.4; 22 4.293,1.2; 23 4.293,2; 24 4.293,2.8 | smd 0.559 x 1.27: 9 -2.8,-4.293; 10 -2,-4.293; 11 -1.2,-4.293; 12 -0.4,-4.293; 13 0.4,-4.293; 14 1.2,-4.293; 15 2,-4.293; 16 2.8,-4.293; 25 2.8,4.293; 26 2,4.293; 27 1.2,4.293; 28 0.4,4.293; 29 -0.4,4.293; 30 -1.2,4.293; 31 -2,4.293; 32 -2.8,4.293
SO14W = smd 0.6 x 2.2: 1 -3.81,-4.6; 2 -2.54,-4.6; 3 -1.27,-4.6; 4 0,-4.6; 5 1.27,-4.6; 6 2.54,-4.6; 7 3.81,-4.6; 8 3.81,4.6; 9 2.54,4.6; 10 1.27,4.6; 11 0,4.6; 12 -1.27,4.6; 13 -2.54,4.6; 14 -3.81,4.6
TO220-52 = drill 1.6 pad 2.5 round: 1 -5.08,-30.48; 2 -2.54,-27.94; 3 0,-30.48; 4 2.54,-27.94; 5 5.08,-30.48 | hole 4.05: 0,-4
SO16 = smd 0.66 x 2.032: 1 -4.445,-3.073; 2 -3.175,-3.073; 3 -1.905,-3.073; 4 -0.635,-3.073; 5 0.635,-3.073; 6 1.905,-3.073; 7 3.175,-3.073; 8 4.445,-3.073; 9 4.445,3.073; 10 3.175,3.073; 11 1.905,3.073; 12 0.635,3.073; 13 -0.635,3.073; 14 -1.905,3.073; 15 -3.175,3.073; 16 -4.445,3.073
SO18L = smd 0.66 x 2.032: 1 -5.08,-4.902; 2 -3.81,-4.902; 3 -2.54,-4.902; 4 -1.27,-4.902; 5 0,-4.902; 6 1.27,-4.902; 7 2.54,-4.902; 8 3.81,-4.902; 9 5.08,-4.902; 10 5.08,4.902; 11 3.81,4.902; 12 2.54,4.902; 13 1.27,4.902; 14 0,4.902; 15 -1.27,4.902; 16 -2.54,4.902; 17 -3.81,4.902; 18 -5.08,4.902
SO8 = smd 0.6 x 1.6: 1 -1.905,-2.6; 2 -0.635,-2.6; 3 0.635,-2.6; 4 1.905,-2.6; 5 1.905,2.6; 6 0.635,2.6; 7 -0.635,2.6; 8 -1.905,2.6
TO252-51 = smd 0.8 x 1.6: IN -1.14,-4.8; IS 1.14,-4.8; OUT1 -2.28,-4.8; OUT2 2.28,-4.8 | smd 5.4 x 6.2: TAB 0,2.5
SPC4077 = drill 0.8 pad 2.184 long: 1 -3,0; 2 0,-4.8 | drill 1 pad 2.184 long: 3 3,0
JP1 = drill 0.914 long: 1 0,-1.27; 2 0,1.27
JP2 = drill 0.914 long: 1 -2.54,0; 2 0,0; 3 2.54,0
R0805 = smd 1.3 x 1.5: 1 -0.95,0; 2 0.95,0
POWER-CHOKE_WE-TPC = smd 6.3 x 2.2: 1 0,2.05; 2 0,-2.05
CHIPLED_0805 = smd 1.2 x 1.2: A 0,-1.05; C 0,1.05
HC49U-V@1 = drill 0.813 round: 1 -2.413,0; 2 2.413,0
HC49U-V = drill 0.813 round: 1 -2.413,0; 2 2.413,0
M0805 = smd 1.3 x 1.6: 1 -0.95,0; 2 0.95,0
RJ10 = drill 0.9 round: P$1 -1.905,6.55; P$2 -0.953,9.09; P$3 0.953,6.55; P$4 1.905,9.09 | hole 1.59: -3.81,0.2; 3.81,0.2
SJ = smd 1.168 x 1.6: 1 -0.762,0; 2 0.762,0
ML6 = drill 0.914 octagon: 1 -2.54,-1.27; 2 -2.54,1.27; 3 0,-1.27; 4 0,1.27; 5 2.54,-1.27; 6 2.54,1.27
ML20L = drill 0.914 octagon: 1 -11.43,-1.27; 2 -11.43,1.27; 3 -8.89,-1.27; 4 -8.89,1.27; 5 -6.35,-1.27; 6 -6.35,1.27; 7 -3.81,-1.27; 8 -3.81,1.27; 9 -1.27,-1.27; 10 -1.27,1.27; 11 1.27,-1.27; 12 1.27,1.27; 13 3.81,-1.27; 14 3.81,1.27; 15 6.35,-1.27; 16 6.35,1.27; 17 8.89,-1.27; 18 8.89,1.27; 19 11.43,-1.27; 20 11.43,1.27
SOT23 = smd 1 x 1.4: 1 -0.95,-1.1; 2 0.95,-1.1; 3 0,1.1
F/CM12P = drill 1.016 pad 2.54 octagon: + 3.81,0; - -3.81,0

### Placement (x,y rotation side)
12IN+  53.34,62.23 90 top
12IN-  60.96,67.31 90 top
12OUT+  53.34,72.39 90 top
12OUT-  60.96,77.47 90 top
24IN+  53.34,41.91 90 top
24IN-  60.96,46.99 90 top
ACTU+  53.34,52.07 90 top
ACTU-  60.96,57.15 90 top
C3  31.75,73.66 270 top
C4  19.05,73.66 270 top
C5  28.26,32.38 0 bottom
C6  25.08,32.38 0 bottom
C10  25.4,30.8 0 bottom
C11  25.4,29.21 0 bottom
C12  23.81,47.94 180 top
C13  26.04,46.99 270 top
C14  26.04,46.99 270 bottom
C16  24.45,46.99 90 bottom
C17  15.24,34.92 180 bottom
C18  19.68,53.34 90 bottom
C19  19.68,49.53 90 bottom
C20  14.61,55.88 0 bottom
C21  19.68,46.35 270 bottom
C22  5.08,31.75 0 bottom
C23  5.08,30.48 0 bottom
C24  5.08,22.86 180 bottom
C25  9.53,53.34 270 bottom
D1  46.35,72.39 270 bottom
D3  26.67,73.66 90 top
EXT+  53.34,82.55 90 top
EXT-  60.96,87.63 90 top
F2-0.5A  39.37,72.39 180 top
H5  5,95 0 top
H6  60,95 0 top
H7  5,5 0 top
H8  60,5 0 top
IC1  26.67,39.37 90 bottom
IC3  30.48,64.77 90 top
IC4  41.91,45.72 0 top
IC7  14.61,49.53 270 bottom
IC8  15.24,27.94 90 bottom
IC9  5.08,17.78 180 bottom
IC10  53.34,62.23 180 bottom
IC11  53.34,48.26 180 bottom
IC12  53.34,35.56 0 bottom
IC15  53.34,82.55 0 bottom
J1  49.53,93.98 270 top
JP1  6.35,11.43 0 top
JP2  46.99,4.45 270 top
JP3  41.91,4.45 270 top
JP4  36.83,4.45 270 top
JP5  52.07,4.45 270 top
KICK+  53.34,31.75 90 top
KICK-  60.96,36.83 90 top
L1  22.86,46.99 90 bottom
L3  19.05,63.5 270 top
LED1  53.34,47.62 90 top
LED2  53.34,67.94 90 top
LED3  60.96,20.64 90 top
LED4  53.34,57.78 90 top
LED5  13.97,74.93 0 top
LED6  60.96,30.8 90 top
MOT1+  53.34,12.7 90 top
MOT1-  60.96,16.51 90 top
MOT2+  53.34,21.59 90 top
MOT2-  60.96,26.67 90 top
Q1  22.86,31.11 90 top
Q2  5.71,31.11 90 top
R1  23.5,45.72 180 top
R2  28.57,52.07 270 bottom
R3  28.57,55.88 270 bottom
R4  61.91,58.42 90 bottom
R5  8.89,80.01 90 bottom
R6  3.81,11.43 270 bottom
R7  62.87,67.63 90 bottom
R8  31.75,52.07 270 bottom
R9  34.92,52.07 270 bottom
R10  31.75,55.88 270 bottom
R11  34.92,55.88 90 bottom
R12  62.23,27.94 90 bottom
R13  43.18,64.77 180 bottom
R14  44.45,31.75 90 bottom
R15  59.69,24.13 90 bottom
R16  59.37,69.53 0 bottom
R17  58.42,54.61 90 bottom
R18  13.97,71.12 270 top
R19  46.99,49.85 270 bottom
R20  44.45,21.59 270 bottom
R21  46.99,80.01 180 bottom
R22  46.99,82.55 180 bottom
R23  58.42,34.29 90 bottom
R24  61.91,38.1 90 bottom
R25  61.91,54.61 270 bottom
R26  61.91,64.77 0 bottom
R27  62.23,24.13 270 bottom
R28  58.1,63.18 0 top
R29  61.91,34.29 270 bottom
R30  43.18,59.69 180 bottom
R35  46.99,59.69 90 bottom
R36  41.59,52.7 90 bottom
R37  43.18,55.88 0 bottom
R38  36.83,29.21 180 bottom
R39  40.64,31.75 90 bottom
R40  41.91,22.86 270 bottom
R41  41.91,19.05 270 bottom
R42  36.83,26.67 0 bottom
R43  41.91,26.67 270 bottom
R44  43.18,49.53 0 bottom
R45  45.72,64.77 90 top
R46  45.72,60.96 90 top
R47  40.64,34.29 180 bottom
R48  39.37,21.59 270 bottom
R49  47.31,55.88 180 bottom
R50  46.99,64.77 90 bottom
RJ_1  27.94,10.16 0 top
RJ_2  15.24,10.16 0 top
SJ2  6.35,17.78 270 top
SV1  5.08,52.07 90 top
SV2  26.67,93.98 0 top
SV3  13.97,39.37 180 top
T1  5.71,79.38 270 bottom
T2  58.42,38.1 270 bottom
T5  59.37,66.36 180 bottom
T6  58.42,58.42 270 bottom
T7  58.74,27.94 270 bottom
TDB-05  7.62,83.82 0 top
VR6  45.72,62.23 90 bottom
VR7  45.72,52.7 90 bottom
VR8  36.83,31.75 270 bottom
VR9  35.56,21.59 270 bottom
VR10  43.18,60.96 180 top

### Tracks (layer width: path | path; a pad name or v marks a point on that pad's centre or on a via)
12V
  Bottom 0.813: IC10.OUT1 51.06,68.84 52.07,69.85 D1.P$2 54.61,69.85 55.62,68.84 IC10.OUT2
12VIN  (via drill 0.3)
  Top 0.254: R28.1 53.02,63.18 52.07,62.23
  Top 0.406: v49.53,60.96 49.53,59.37 47.94,57.78 43.18,57.78 40.96,60.01 v39.37,60.01
  Top 0.813: v57.15,60.96 55.88,62.23 12IN+.P$1 52.07,62.23 50.8,62.23 v49.53,60.96
  Bottom 0.254: R35.2 47.31,60.96 v49.53,60.96
  Bottom 0.406: v39.37,60.01 29.53,60.01 28.57,59.05 R3.1
  Bottom 0.813: v49.53,60.96 50.76,59.73 IC10.TAB 55.92,59.73 v57.15,60.96
12VOUT  (via drill 0.3, 1)
  Top 0.254: 12OUT+.P$1 58.42,72.39 v59.69,71.12
  Top 1.676: F2-0.5A.1 v48.26,72.39 12OUT+.P$1
  Bottom 0.254: R16.1 60.32,70.49 v59.69,71.12
  Bottom 1.676: v48.26,72.39 D1.P$3
24VIN  (via drill 0.3, 0.6)  (1 unrouted)
  Top 0.406: v39.37,44.45 40.32,45.4 v40.32,48.58
  Bottom 0.254: IC4.3 R41.2 | R39.2 40.64,38.1 v39.37,39.37
  Bottom 0.406: 35.24,57.15 R11.2 38.42,56.83 39.37,55.88 40.32,55.88 | v49.53,44.45 50.16,45.09 | 40.32,55.88 R37.2 | v40.32,48.58 40.32,55.88
  other vias: 36.83,44.45 34.29,41.91 34.29,44.45 36.83,41.91 36.83,39.37 34.29,39.37 44.45,44.45 44.45,39.37 46.99,39.37 46.99,41.91 46.99,44.45 49.53,41.91 49.53,39.37 49.53,36.83 46.99,36.83 44.45,36.83 41.91,36.83 39.37,36.83 36.83,36.83 34.29,36.83
  pour Top: 49.53,36.83 34.29,36.83 34.29,46.99 49.53,46.99 49.53,45.72 56.83,45.72 56.83,38.1 49.53,38.1
  pour Bottom: 34.29,46.99 56.83,46.99 56.83,36.83 34.29,36.83
+5V  (via drill 0.3)
  Top 0.254: SJ2.1 v6.35,24.13
  Top 0.406: 17.71,69.92 17.46,70.17 R18.2 13.65,70.17 12.7,71.12 12.7,82.55 TDB-05.+ | IC3.3 36.83,63.5 39.69,66.36 v39.69,78.74 | v20,39.69 20,58.42 | v22.86,58.42 22.86,48.02 C12.2 L1.2 22.86,46.03 R1.2 22.55,42.54 26.67,38.42 v26.67,36.51
  Top 0.61: L3.2 17,69.21 17.71,69.92 C4.+ 21.45,73.66 v22.86,73.66
  Top 0.813: SV2.9 SV2.10 | IC3.3 33.02,63.5 27.94,58.42 v22.86,58.42 20,58.42 v19.05,58.42 17,60.47 L3.2
  Bottom 0.254: 5.71,22.64 C24.2 5.93,23.71 v6.35,24.13 8.89,26.67 IC8.4 | 11.75,27.94 11.75,23.81 12.7,22.86 IC8.18 | T5.3 59.37,63.34 59.69,63.34
  Bottom 0.406: C5.2 27.07,32.7 IC1.4 27.07,36.11 v26.67,36.51 26.04,36.51 25.47,35.95 IC1.6 25.47,33.65 C6.2 | IC8.5 IC8.6 | IC8.4 IC8.5 | IC8.5 11.75,27.94 11.75,31.75 13.02,33.02 IC8.10 20.14,33.2 18.41,34.92 16.51,34.92 SV3.2 | 63.82,41.91 63.82,20.64 63.5,20.32 59.69,20.32 58.42,21.59 58.42,25.08 57.64,25.86 T7.3 | T2.3 57.32,39.54 59.69,41.91 63.82,41.91 | T6.3 57.32,59.86 57.94,60.48 57.94,63.34 | v39.69,78.74 46.99,78.74 49.53,76.2 49.53,74.93 52.07,72.39 56.52,72.39 56.52,63.34 57.94,63.34 | v19.05,58.42 12.7,58.42 9.53,55.24 C25.1 | SV3.2 16.51,35.34 C17.2 | SV3.2 18.41,38.1 v20,39.69 | 63.82,41.91 63.82,61.59 62.07,63.34 59.69,63.34 57.94,63.34 | v22.86,58.42 L1.2
  Bottom 0.61: IC8.10 18.24,34.92 16.51,34.92 C17.2 | 5.71,22.64 IC9.3 | C25.1 9.77,53.98 IC7.16 | v22.86,73.66 22.86,90.17 SV2.9
  pour Top (no thermals): 20.95,73.03 17.14,73.03 15.88,71.75 15.88,60.33 16.51,59.69 18.41,59.69 19.05,60.33 19.05,69.22 20.95,71.12
ADC0
  Bottom 0.406: R3.2 29.52,54.93 29.84,54.61 29.84,51.44 29.53,51.12 R2.2 28.57,43.76 IC1.23
ADC1
  Bottom 0.406: R10.2 30.8,54.93 30.48,54.61 30.48,51.44 30.8,51.12 R8.2 29.47,48.84 IC1.24
ADC2
  Bottom 0.406: R11.1 35.88,54.93 36.83,53.98 36.83,52.07 35.88,51.12 R9.2 34.92,49.85 34.29,49.21 33.34,49.21 30.96,46.84 IC1.25
ADC3  (via drill 0.3)
  Top 0.254: v39.37,54.61 v39.37,57.15
  Bottom 0.254: IC1.26 31.84,41.37 32.7,42.23 32.7,47.62 33.66,48.58 38.42,48.58 39.37,49.53 v39.37,54.61 | v39.37,57.15 40.96,58.74 40.96,65.41 41.59,66.04 42.86,66.04 R13.2 53.34,64.77 54.48,65.91 IC10.IS
ADC4
  Bottom 0.254: IC11.IS 54.48,51.94 53.34,50.8 49.53,50.8 47.63,48.9 R19.2 46.03,47.94 33.66,47.94 33.34,47.62 33.34,40.96 32.95,40.57 IC1.27
ADC5
  Bottom 0.254: IC1.28 32.62,39.77 33.02,39.37 33.02,36.83 36.83,33.02 36.83,32.07 37.15,31.75 43.5,31.75 R14.2 44.45,33.34 44.77,33.66 47.62,33.66 48.9,32.38 51.75,32.38 52.2,31.94 IC12.IS
ADC6  (via drill 0.3)
  Top 0.406: IC4.4 41.91,17.78 33.97,25.72 33.97,27.94 27.94,33.97 27.94,39.19 v25.47,41.66
  Bottom 0.254: IC4.4 R20.2
  Bottom 0.406: v25.47,41.66 IC1.19
ADC7  (via drill 0.3)
  Top 0.406: v36.83,62.55 36.83,52.07 35.24,50.48 28.89,50.48 v27.87,49.46
  Bottom 0.406: IC15.IS 52.2,78.93 51.12,80.01 R21.2 47.94,80.97 47.62,81.28 47.3,81.28 38.1,81.28 36.83,80.01 v36.83,62.55 | IC1.22 v27.87,49.46
AKTUATOR  (via drill 0.6)
  Top 1.676: v52.07,55.88 53.34,55.88 | 53.34,55.88 v54.61,55.88 | 53.34,55.88 ACTU+.P$1
  Bottom 0.254: R17.1 58.1,53.34 55.88,53.34 55.62,53.08 IC11.OUT2
  Bottom 0.813: IC11.OUT1 51.06,54.87 v52.07,55.88 | IC11.OUT2 55.62,54.87 v54.61,55.88
CANH
  Bottom 0.254: RJ_1.P$3 28.89,15.88 28.26,15.24 26.04,15.24 24.57,16.71 RJ_2.P$3 15.04,16.71 13.97,17.78 5.08,17.78 4.45,17.14 IC9.7 4.45,13.02 R6.1
CANL
  Top 0.254: RJ_2.P$2 12.9,19.25 11.43,17.78 11.43,13.97 10.16,12.7 JP1.2
  Bottom 0.254: RJ_2.P$2 14.29,18.41 14.61,18.1 26.67,18.1 26.99,18.41 RJ_1.P$2 | IC9.6 5.71,14.29 6.35,13.65 JP1.2
CS  (via drill 0.3)
  Top 0.254: v18.41,25.4 v18.41,37.15
  Bottom 0.254: IC8.16 v18.41,25.4 | IC1.12 20.24,38.97 v18.41,37.15
EXT
  Bottom 0.813: IC15.OUT2 51.06,75.94 52.07,74.93 D1.P$1 54.61,74.93 55.62,75.94 IC15.OUT1
EXTIN  (via drill 0.3)
  Top 0.254: R45.2 v40.33,65.72 v40.32,65.72
  Top 0.406: v49.53,83.82 46.04,83.82 40.32,78.11 v40.32,65.72 40.32,68.58
  Top 0.813: v57.15,83.82 55.88,82.55 EXT+.P$1 50.8,82.55 v49.53,83.82
  Bottom 0.406: R10.1 31.75,58.1 32.7,59.05 39.69,59.05 40.32,59.69 v40.32,65.72
  Bottom 0.813: v49.53,83.82 50.76,85.05 IC15.TAB 54.57,85.05 54.61,85.09 55.88,85.09 v57.15,83.82
GND  (via drill 0.3)  (2 unrouted)
  Top 0.254: RJ_2.P$4 17.14,20 17.78,20.64 29.21,20.64 29.84,20 RJ_1.P$4 | VR10.3 45.57,59.86 R46.1 v45.72,58.74 | 60.96,20.64 LED3.C | LED5.C 14.07,75.88 | v37.78,63.5 v41.59,63.5 | v45.4,48.58 60.33,48.58 60.96,47.94 | 60.96,60.96 60.96,61.28 | LED2.C 52.29,66.77 53.34,65.72 59.37,65.72 12IN-.P$1 | LED6.C 60.96,30.8 60.96,30.48
  Top 0.406: SV2.2 SV2.1 v15.24,76.06 | C4.- 18.97,75.98 | H8.B2,8 60.96,5.96 MOT1-.P$1 | MOT1-.P$1 59.91,17.56 | MOT2-.P$1 59.91,27.72 | 24IN-.P$1 KICK-.P$1 60.96,30.48 MOT2-.P$1 | 24IN-.P$1 59.91,48.04 | H6.B2,8 60.96,94.04 EXT-.P$1 12OUT-.P$1 12IN-.P$1 60.96,60.96 ACTU-.P$1 60.96,47.94 24IN-.P$1 | MOT1-.P$1 60.96,20.64 MOT2-.P$1 | 30.16,46.04 30.16,46.67 33.34,49.85 36.2,49.85 37.78,51.44 v37.78,58.1 v37.78,63.5 | MOT2-.P$1 60.96,26.35 v55.88,26.35 | 30.16,46.04 v27.07,46.04 27.07,47.54 26.75,47.87 C13.1 25.96,47.94 C12.1 | 30.16,46.04 v30.16,32.7 | v37.78,65.72 37.78,67.31 38.1,67.31
  Top 0.61: 26.67,75.71 C3.- 36.83,75.71 | D3.A 19.05,75.86 | 36.83,75.71 37.32,75.71 38.73,74.3 38.73,67.31 38.1,67.31 IC3.6 | v38.1,80.01 36.83,78.74 36.83,75.71 | LED5.C 14.05,76.06 v15.24,76.06 C4.- | 12OUT-.P$1 48.26,77.47 45.72,80.01 v44.45,80.01
  Top 0.813: IC3.6 IC3.5 IC3.4
  Top 1.422: 26.67,75.71 D3.A | 19.05,75.86 C4.-
  Bottom 0.254: 26.27,32.07 C6.1 | 4.45,22.64 C24.1 3.81,22.86 2.54,21.59 2.54,15.18 IC9.8 | R19.1 45.72,50.8 45.4,50.48 45.4,49.53 | 42.23,63.5 R30.1 | 42.23,63.5 R13.1 | RJ_1.P$4 29.84,20 29.21,20.64 27.62,20.64 26.27,21.98 C11.1 | SV2.2 5.25,95.25 H5.B2,8 | H7.B2,8 5,3.89 6.99,1.91 JP4.3 | R30.1 42.23,62.23 | v41.59,63.5 42.23,63.5 | v45.4,48.58 45.4,49.53 | 45.4,49.53 R44.1 | v45.72,58.74 45.4,58.42 42.55,58.42 42.23,58.74 R30.1
  Bottom 0.406: C6.1 26.27,32.7 IC1.5 | C5.1 27.87,33.65 IC1.3 | C10.1 26.27,32.07 | C21.2 19.29,45.09 IC7.8 15.77,43.18 12.7,43.18 | C20.2 13.73,53.73 12.7,52.7 IC7.15 | C10.1 C11.1 | 9.21,47.62 9.21,45.4 11.43,43.18 12.7,43.18 | 9.21,47.62 IC7.11 | 9.21,47.62 9.21,51.44 9.53,51.75 C25.2 8.49,52.47 SV1.5 15.24,63.5 v15.24,76.06 6.82,76.06 T1.2 | 44.45,27.62 R20.1 | 43.5,27.62 R43.1 38.73,27.62 R42.1 38.73,27.62 44.45,27.62 | 44.45,27.62 R14.1 | H8.B2,8 56.91,1.91 JP5.3 JP2.3 JP3.3 JP4.3 | 11.43,34.92 SV3.6 12.7,39.37 12.7,43.18 | C24.1 C23.2 C22.2 4.23,34.08 5.08,34.92 6.35,34.92 8.26,33.02 IC8.9 10.34,33.83 11.43,34.92 | 11.43,34.92 C17.1 | C5.1 29.13,31.67 28.26,30.8 C10.1 | IC1.21 v27.07,46.04 27.07,47.87 | v37.78,65.72 v37.78,63.5 | 44.45,27.62 45.72,27.62 46.99,26.35 v55.88,26.35 | 33.34,53.02 R8.1 | 33.34,53.02 R9.1 | 33.34,53.02 33.34,57.47 33.97,58.1 v37.78,58.1 | v30.16,32.7 29.84,32.38 C5.1 | C16.2 C13.1 27.07,47.87 | 27.07,47.87 27.07,52.47 27.62,53.02 R2.1
  Bottom 0.61: 4.45,22.64 IC9.2 | IC7.15 9.77,52.7 C25.2 | R21.1 v44.45,80.01 v38.1,80.01
ICLED_GELB  (via drill 0.3)
  Top 0.254: v31.11,34.29 v49.53,34.29 | v62.87,40.64 63.82,41.59 63.82,51.44 v62.87,52.39
  Bottom 0.254: T6.2 R4.1 R25.1 62.87,55.56 63.18,55.24 63.18,52.7 v62.87,52.39 | R24.1 R29.1 60.96,35.24 60.01,34.29 v49.53,34.29 | R24.1 T2.2 | IC1.1 30.33,35.08 v31.11,34.29 | R24.1 62.87,37.15 63.18,37.47 63.18,40.32 v62.87,40.64
ICLED_GRUEN  (via drill 0.3)
  Top 0.254: v45.72,33.02 45.09,33.66 v31.75,33.66
  Bottom 0.254: 62.23,26.67 R27.1 | 62.23,26.67 R12.1 | 62.23,26.67 61.91,26.99 60.96,26.99 | 60.96,26.99 T7.2 | 28.67,34.83 IC1.2 28.67,34.2 29.21,33.66 v31.75,33.66 | 60.96,26.99 60.96,29.84 60.33,30.48 58.42,30.48 54.93,26.99 47.94,26.99 45.72,29.21 v45.72,33.02
ICLED_ROT  (via drill 0.3)  (1 unrouted)
  Top 0.254: 58.1,60.64 57.47,60.01 57.47,50.48 56.2,49.21 38.42,49.21 37.15,47.94 33.66,47.94 33.34,47.62 v33.34,35.56
  Bottom 0.254: IC1.32 32.33,36.57 v33.34,35.56 | R26.1 R7.1 61.91,66.68 61.13,67.46 T5.2
INT  (via drill 0.3)
  Top 0.254: v17.46,30.48 v17.46,36.51
  Bottom 0.254: v17.46,30.48 IC8.12 | IC1.9 17.72,36.57 17.66,36.51 v17.46,36.51
KICKER  (via drill 0.6)
  Top 1.676: v52.07,27.94 53.34,27.94 | 53.34,27.94 v54.61,27.94 | 53.34,27.94 KICK+.P$1
  Bottom 0.254: R23.1 56.2,33.34 55.62,32.76 IC12.OUT1
  Bottom 0.813: IC12.OUT2 51.06,28.95 v52.07,27.94 | IC12.OUT1 55.62,28.95 v54.61,27.94
LED_GELB  (via drill 0.3)
  Top 0.254: v58.42,41.91 v59.69,40.64 | v58.1,50.16 58.1,60.01 v58.74,60.64 | v61.91,62.55 63.18,62.55 63.82,63.18 63.82,96.52 61.91,98.42 v26.99,98.42
  Bottom 0.254: R24.2 61.28,39.05 v59.69,40.64 | v26.99,98.42 20.95,98.42 19.05,96.52 19.05,93.98 SV2.5 | v58.1,50.16 58.1,42.23 v58.42,41.91 | v58.74,60.64 61.91,60.64 | 61.91,60.64 R4.2 | 61.91,60.64 v61.91,62.55
LED_GRUEN  (via drill 0.3)
  Top 0.254: v62.87,32.07 64.45,33.66 64.45,96.84 62.23,99.06 26.67,99.06 24.13,96.52 24.13,93.98 SV2.7
  Bottom 0.254: v62.87,32.07 62.87,30.48 62.23,29.84 R12.2
LED_ROT  (via drill 0.3)
  Top 0.254: v59.37,83.5 56.52,86.36 24.13,86.36 SV2.3
  Bottom 0.254: R7.2 62.87,80.01 v59.37,83.5
MISO  (via drill 0.3)
  Top 0.254: v15.56,26.67 15.56,39.69 SV3.1
  Bottom 0.254: v15.56,26.67 IC8.15 | IC1.16 18.04,42.17 SV3.1
MOSI  (via drill 0.3)
  Top 0.254: v13.97,27.94 SV3.4
  Bottom 0.254: v13.97,27.94 IC8.14 | IC1.15 18.83,41.37 16.83,39.37 15.24,39.37 SV3.4
MOTION  (via drill 0.3)
  Top 0.254: v59.37,21.91 53.66,21.91 MOT2+.P$1
  Bottom 0.254: R15.1 59.37,22.86 v59.37,21.91
  pour Top: 34.29,13.34 34.29,16.51 35.56,17.78 36.83,17.78 39.37,15.24 39.37,13.97 40.64,12.7 43.18,12.7 44.45,13.97 44.45,15.24 46.99,17.78 46.99,22.23 49.85,25.08 57.15,25.08 57.15,8.89 38.73,8.89
N$1
  Bottom 0.406: T1.1 7.45,80.96 R5.2
N$2  (via drill 0.3)
  Top 0.254: RJ_2.P$1 13.34,17.46 13.97,18.1 25.4,18.1 26.04,17.46 RJ_1.P$1 | SJ2.2 v8.38,17.02
  Bottom 0.254: v8.38,17.02 13.03,17.02 RJ_2.P$1
N$3
  Bottom 0.254: R22.2 48.9,82.55 50.16,81.28 52.39,81.28 54.48,79.19 IC15.IN
N$4
  Bottom 0.254: R23.2 58.42,38.73 58.74,39.05 T2.1
N$5  (via drill 0.3)
  Top 0.254: LED6.A 61.91,30.89 v61.91,32.07
  Bottom 0.254: v61.91,32.07 R29.2
N$7
  Bottom 0.254: JP1.1 4.13,10.16 R6.2
N$8  (1 unrouted)
N$9  (via drill 0.3)
  Top 0.254: LED2.A 54.39,66.89 54.93,66.36 v57.47,66.36
  Bottom 0.254: R26.2 60.96,66.04 60.64,66.36 v57.47,66.36
N$10
  Bottom 0.406: IC1.7 24.67,34.2 24.13,33.66 22.99,33.66 Q1.2 22.86,31.75 23.81,30.8 C10.2
N$11
  Bottom 0.406: IC1.8 22.38,35.08 21.59,34.29 21.59,29.97 Q1.1 23.37,29.21 C11.2
N$12  (via drill 0.3)
  Top 0.254: v48.26,52.07 40.32,52.07 36.83,48.58 33.66,48.58 32.7,47.62 v32.7,34.92 | v36.51,19.37 35.24,19.37 33.97,20.64 v33.97,24.77
  Bottom 0.254: VR7.3 47.62,52.7 v48.26,52.07 | v36.51,19.37 36.51,18.41 44.61,10.32 44.61,5.24 45.4,4.45 JP2.2 | v33.97,24.77 33.97,33.66 v32.7,34.92
N$13
  Bottom 0.406: IC1.20 26.27,44.85 26.04,45.09 C14.2
N$14
  Bottom 0.406: IC1.18 24.67,44.86 24.45,45.09 C16.1 22.93,46.12 L1.1
N$15
  Bottom 0.406: C18.2 19.45,53.98 IC7.1
N$18
  Bottom 0.406: C19.2 19.45,50.16 IC7.4
N$19
  Bottom 0.254: JP4.2 38.42,4.45 39.37,5.4 39.37,8.89 34.14,14.12 34.14,21.27 VR9.3
N$20
  Bottom 0.406: TDB-05.- 4.62,83.02 T1.3
N$21  (via drill 0.3)
  Top 0.254: LED3.A 62.23,20.86 v62.23,21.91
  Bottom 0.254: v62.23,21.91 R27.2
N$22
  Top 0.61: 31.75,71.12 C3.+ | 31.75,71.12 31.75,68.58 29.21,66.04 IC3.10 | 31.75,71.12 31.84,71.21
  Top 0.813: C3.+ 31.75,72.39
  Top 1.676: 31.75,72.39 F2-0.5A.2
  pour Top (no thermals): 33.66,73.03 31.11,73.03 30.48,72.39 30.48,70.48 27.94,67.94 27.94,64.77 28.57,64.14 32.38,64.14 33.02,64.77 33.02,68.58 34.29,69.85 34.29,72.39
N$23
  Bottom 0.254: VR8.3 34.61,30.63 34.61,25.08 35.56,24.13 35.56,18.73 44.13,10.16 44.13,5.08 43.5,4.45 JP3.2
N$24  (1 unrouted)
  Top 0.254: R28.2 58.74,62.87
N$25  (via drill 0.3)
  Top 0.254: v32.07,35.88 32.07,47.62 33.66,49.21 36.51,49.21 38.73,51.44 v38.73,60.96 46.99,60.96 v48.58,62.55 | v38.73,7.3 38.73,6.67 39.37,6.03 43.5,6.03 45.4,7.94 48.9,7.94 49.53,7.3 49.53,5.08 50.16,4.45 JP5.2
  Bottom 0.254: R22.1 38.42,82.55 36.2,80.33 36.2,62.23 37.47,60.96 v38.73,60.96 | 46.82,62.06 VR6.3 47.14,62.55 v48.58,62.55 | v32.07,35.88 32.07,34.61 33.34,33.34 33.34,14.29 38.73,8.89 v38.73,7.3
N$28
  Bottom 0.254: R50.2 51.75,65.72 52.2,66.17 IC10.IN
N$32
  Bottom 0.406: IC8.8 C22.1 5.93,33.31 Q2.2
N$33  (via drill 0.3)
  Top 0.254: VR10.1 44.3,62.23 43.5,62.23 43.18,62.55 v43.18,63.18
  Bottom 0.254: R35.1 46.04,59.69 R30.2 43.18,60.64 v43.18,63.18 VR6.2
N$34
  Bottom 0.406: IC8.7 C23.1 5.93,28.92 Q2.1
N$35
  Bottom 0.406: C18.1 18.66,51.44 IC7.3
N$36
  Bottom 0.406: IC7.5 19.45,48.9 C19.1
N$37
  Bottom 0.406: IC7.2 16.51,52.7 15.48,53.73 C20.1
N$38
  Bottom 0.406: IC7.6 19.29,47.62 C21.1
N$39
  Bottom 0.254: R49.1 46.35,54.61 45.72,53.98 45.72,52.07 45.4,51.75 VR7.1
N$40  (via drill 0.3)
  Top 0.254: SV1.3 8.26,50.16 v9.94,50.16
  Bottom 0.254: v9.94,50.16 IC7.13
N$41  (via drill 0.3)
  Top 0.254: v15.24,46.99 13.97,48.26 7.62,48.26 SV1.1
  Bottom 0.254: IC7.7 15.88,46.35 v15.24,46.99
N$42
  Bottom 0.254: R36.2 VR7.2 44.62,54.44 44.13,54.93 R37.1
N$43
  Bottom 0.254: IC12.IN 54.48,31.88 53.34,33.02 49.21,33.02 47.94,34.29 R47.2
N$44
  Bottom 0.254: R38.2 37.93,29.36 VR8.2 R39.1
N$45
  Bottom 0.254: R41.1 R40.2 41.59,21.59 37.61,21.59 VR9.2
N$46
  Bottom 0.254: IC4.2 R48.2
N$47
  Bottom 0.254: R42.2 R38.1
N$48
  Bottom 0.254: R40.1 R43.2
N$49
  Bottom 0.254: R44.2 41.27,49.53 40.96,49.85 40.96,50.16 41.59,50.8 R36.1
N$50
  Top 0.254: R46.2 R45.1 42.86,63.82 42.23,63.19 VR10.2
N$51
  Bottom 0.254: VR8.1 38.1,32.7 R47.1
N$52
  Bottom 0.254: VR9.1 R48.1
N$53
  Bottom 0.254: R49.2 48.26,54.61 49.53,53.34 49.53,51.75 49.85,51.44 51.75,51.44 52.2,51.88 IC11.IN
N$54
  Bottom 0.254: VR6.1 45.72,62.38 45.72,63.5 46.04,63.82 R50.1
N$64
  Top 0.61: 21.59,63.5 IC3.12 | L3.1 21.59,63.5 | D3.C 23.2,71.46 21.59,69.85 21.59,63.5
  pour Top (no thermals): 28.57,73.03 24.13,73.03 20.32,69.22 20.32,60.33 20.95,59.69 22.86,59.69 23.5,60.33 23.5,69.22 24.13,69.85 28.57,69.85 29.21,70.48 29.21,72.39
N$102  (1 unrouted)
N$104
  Bottom 0.254: R17.2 58.42,59.05 58.74,59.37 T6.1
N$106
  Bottom 0.254: R15.2 59.38,25.08 58.74,25.72 58.74,28.57 59.05,28.89 59.52,28.89 T7.1
N$108
  Top 0.406: R18.1 LED5.A
RESET  (via drill 0.3)
  Top 0.254: SV3.5 12.38,39.69 v12.38,24.13
  Bottom 0.254: v12.38,24.13 IC8.17
RST  (via drill 0.3)
  Top 0.406: v26.99,39.05 24.45,41.59 R1.1 24.84,46.12 C13.2
  Bottom 0.406: v26.99,39.05 27.07,38.97 IC1.29
RXCAN
  Bottom 0.254: IC8.2 7.62,24.13 6.99,23.5 IC9.4
RXD  (via drill 0.3)
  Top 0.254: v13.34,48.9 15.88,48.9 18.41,46.35 18.41,40.01 21.27,37.15 v24.13,37.15
  Bottom 0.254: v13.34,48.9 IC7.12 | IC1.30 25.15,38.17 v24.13,37.15
SCK  (via drill 0.3)
  Top 0.254: v13.02,29.21 13.02,39.69 SV3.3
  Bottom 0.254: v13.02,29.21 IC8.13 | IC1.17 16.99,43.66 SV3.3
SPEAKER  (via drill 0.3)
  Top 0.254: v19.05,40.64 19.05,55.88 15.24,59.69 15.24,66.04 11.43,69.85 11.43,77.47 v10.16,78.74
  Bottom 0.254: IC1.14 19.12,40.57 v19.05,40.64 | v10.16,78.74 9.21,78.74 R5.1
SW_12V
  Bottom 0.254: JP5.1 53.98,6.99 54.61,6.35 54.61,3.81 53.66,2.86 14.92,2.86 9.21,8.57 2.86,8.57 1.27,10.16 1.27,83.82 11.43,93.98 16.51,93.98 SV2.4
SW_AKT  (via drill 0.3)
  Top 0.254: v20.95,57.47 20.64,57.15 20.64,38.73 21.27,38.1 v24.13,38.1 24.77,37.47 24.77,34.61 32.7,26.67 32.7,12.7 34.92,10.48 34.92,6.67 36.2,5.4 46.35,5.4 46.99,6.03 JP2.1
  Bottom 0.254: v20.95,57.47 21.27,57.78 21.27,94.3 SV2.6 | 21.68,37.37 IC1.10 23.4,37.37 v24.13,38.1
SW_KICK  (via drill 0.3)
  Top 0.254: JP3.1 41.91,7.62 41.59,7.94 38.1,7.94 33.34,12.7 33.34,26.67 25.4,34.61 25.4,37.78 v24.13,39.05
  Bottom 0.254: IC1.11 22.79,38.17 22.86,38.1 23.18,38.1 v24.13,39.05
SW_MOT  (via drill 0.3)
  Top 0.254: v21.27,56.52 v21.27,39.77 24.36,39.77 26.04,38.1 26.04,34.92 v32.7,28.26
  Bottom 0.254: JP4.1 36.83,10.16 32.7,14.29 v32.7,28.26 | v21.27,39.77 IC1.13 | SV2.8 21.91,94.3 21.91,57.15 v21.27,56.52
TXCAN
  Bottom 0.254: IC9.1 3.17,19.37 3.81,18.73 9.84,18.73 10.34,19.23 IC8.1
TXD  (via drill 0.3)
  Top 0.254: v13.34,46.35 17.14,46.35 17.78,45.72 17.78,40.01 21.59,36.2 v24.13,36.2
  Bottom 0.254: IC7.10 v13.34,46.35 | IC1.31 25.3,37.37 v24.13,36.2

### Text on the board
tNames: CN2014 | PowerSwitch-011
Document: Speaker